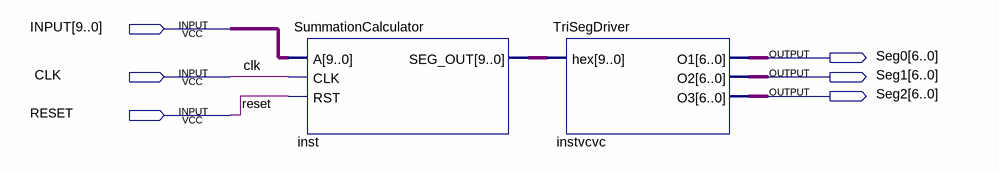
[diagram p0: schematic sheet]
// Quartus schematic DesignProject.bdf as structural Verilog: 2 symbols, 6 pins
module DesignProject (
  input  [9:0] INPUT,
  input  CLK,
  input  RESET,
  output [6:0] Seg0,
  output [6:0] Seg1,
  output [6:0] Seg2
);

  wire [9:0] inst_seg_out;

  SummationCalculator inst (.A(INPUT), .CLK(CLK), .RST(RESET), .SEG_OUT(inst_seg_out));
  TriSegDriver instvcvc (.hex(inst_seg_out), .O1(Seg0), .O2(Seg1), .O3(Seg2));
endmodule
